# Altium schematic sheet V4.0.SchDoc
size 96 x 152 mm
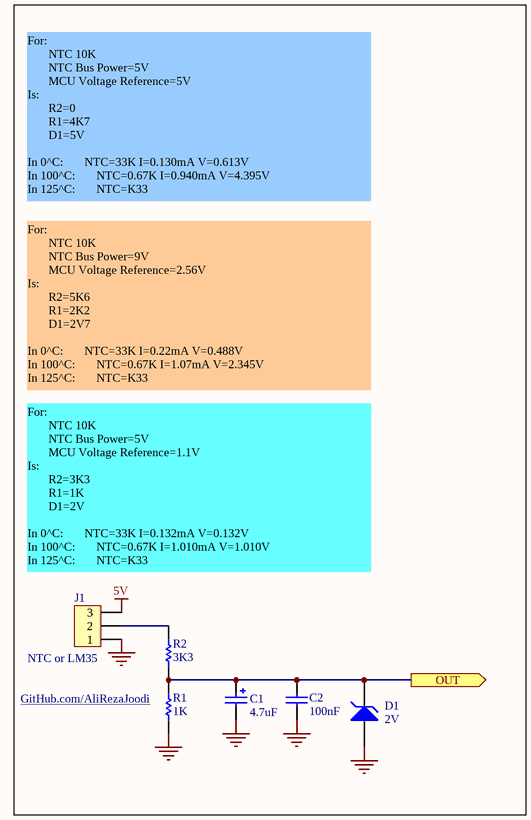
[diagram p0: V4.0.SchDoc]

## Parts
C1  4.7uF  [CAPPR2.5-6.3x5]
C2  100nF  [CAPNTO2.54-3.05x1.78A]
D1  2V  [DIODE0.4_Glass]
J1  3PIN  (value not drawn)
R1  1K  [AXIAL-0.4]
R2  3K3  [AXIAL-0.4]

## Ports
OUT (out)

## Nets
5V: J1.3
GND: C1.2 C2.1 D1.1(A) J1.1 R1.2
OUT: C1.1 C2.2 D1.2(K) R1.1 R2.2 ; port OUT
NetJ1_2: J1.2 R2.1

## Notes on the sheet
- For:
  NTC 10K
  NTC Bus Power=5V
  MCU Voltage Reference=5V
  Is:
  R2=0
  R1=4K7
  D1=5V
  In 0^C: 	     NTC=33K	I=0.130mA	V=0.613V
  In 100^C:       NTC=0.67K	I=0.940mA	V=4.395V
  In 125^C:       NTC=K33
- For:
  NTC 10K
  NTC Bus Power=9V
  MCU Voltage Reference=2.56V
  Is:
  R2=5K6
  R1=2K2
  D1=2V7
  In 0^C: 	     NTC=33K	I=0.22mA	V=0.488V
  In 100^C:       NTC=0.67K	I=1.07mA	V=2.345V
  In 125^C:       NTC=K33
- (near J1) For:
  NTC 10K
  NTC Bus Power=5V
  MCU Voltage Reference=1.1V
  Is:
  R2=3K3
  R1=1K
  D1=2V
  In 0^C: 	     NTC=33K	I=0.132mA	V=0.132V
  In 100^C:       NTC=0.67K	I=1.010mA	V=1.010V
  In 125^C:       NTC=K33
- (near R1) GitHub.com/AliRezaJoodi
- (near J1) NTC or LM35

## Library data of the parts
C1 = Cap Pol1: Polarized Capacitor (Radial); Manufacturer: Generic Components; Class I: Passive; Published: 8-Jun-2000; Revision: July-2002: Re-released for DXP Platform.; Publisher: Altium Limited; Class II: Capacitor
C2 = Cap: Capacitor; Manufacturer: Generic Components; Class I: Passive; Published: 8-Jun-2000; Revision: July-2002: Re-released for DXP Platform.; Publisher: Altium Limited; Class II: Capacitor
D1 = D Zener: Zener Diode; Manufacturer: Generic Components; Class I: Discrete; Class II: Diode - Zener; Published: 8-Jun-2000; Revision: July-2002: Re-released for DXP Platform.; Publisher: Altium Limited
J1 = Connector_Header_3Pin: Connector, Header, 3Pin; Revision: July-2002: Re-released for DXP Platform.
R1 R2 = Res1: Resistor; Published: 8-Jun-2000; LatestRevisionDate: 17-Jul-2002; LatestRevisionNote: Re-released for DXP Platform.; PackageReference: AXIAL-0.3; Publisher: Altium Limited